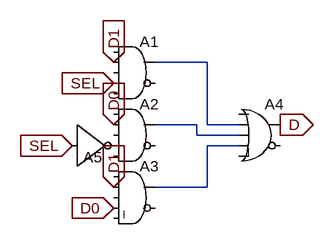
[diagram p0: schematic multiplexer_1x2.asc]
multiplexer_1x2.asc, the LTspice schematic file:
Version 4
SHEET 1 880 680
WIRE 272 48 192 48
WIRE 256 144 192 144
WIRE 272 144 272 48
WIRE 320 144 272 144
WIRE 256 160 256 144
WIRE 320 160 256 160
WIRE 320 176 272 176
WIRE 272 240 272 176
WIRE 272 240 192 240
FLAG 384 144 D
IOPIN 384 144 Out
FLAG 64 176 SEL
IOPIN 64 176 In
FLAG 128 80 SEL
IOPIN 128 80 In
FLAG 128 144 D0
IOPIN 128 144 In
FLAG 128 272 D0
IOPIN 128 272 In
FLAG 128 48 D1
IOPIN 128 48 In
FLAG 128 240 D1
IOPIN 128 240 In
SYMBOL Digital\\and 160 0 R0
SYMATTR InstName A1
SYMBOL Digital\\and 160 96 R0
SYMATTR InstName A2
SYMBOL Digital\\and 160 192 R0
SYMATTR InstName A3
SYMBOL Digital\\or 352 96 R0
SYMATTR InstName A4
SYMBOL Digital\\inv 64 112 R0
WINDOW 0 17 82 Left 2
SYMATTR InstName A5

The netlist it stands for:
* multiplexer_1x2.asc
A1 0 D1 0 SEL 0 0 N001 0 AND
A2 0 D0 0 P001 0 0 N002 0 AND
A3 0 D1 0 D0 0 0 N003 0 AND
A4 0 N001 N002 N003 0 0 D 0 OR
A5 SEL 0 0 0 0 P001 0 0 BUF
.backanno
.end